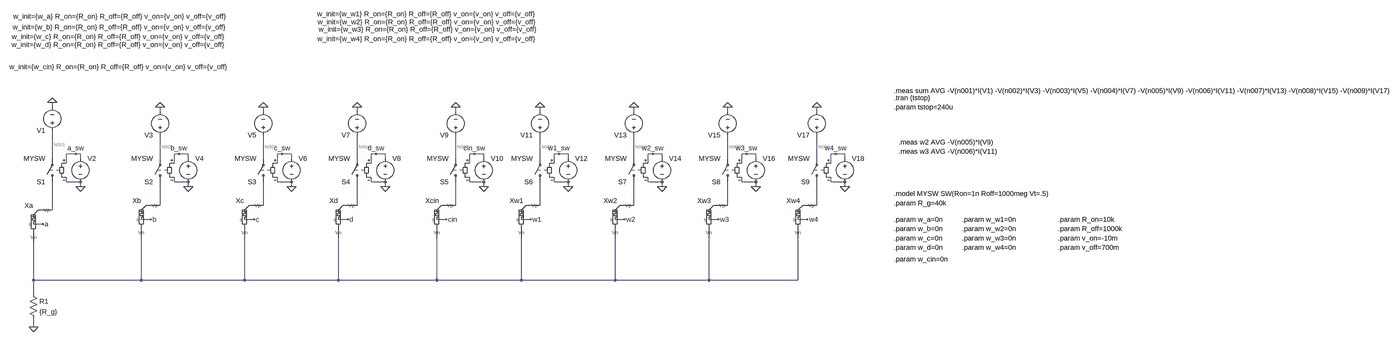
[diagram p0: schematic 1bit_adder_cin.asc, whole sheet]
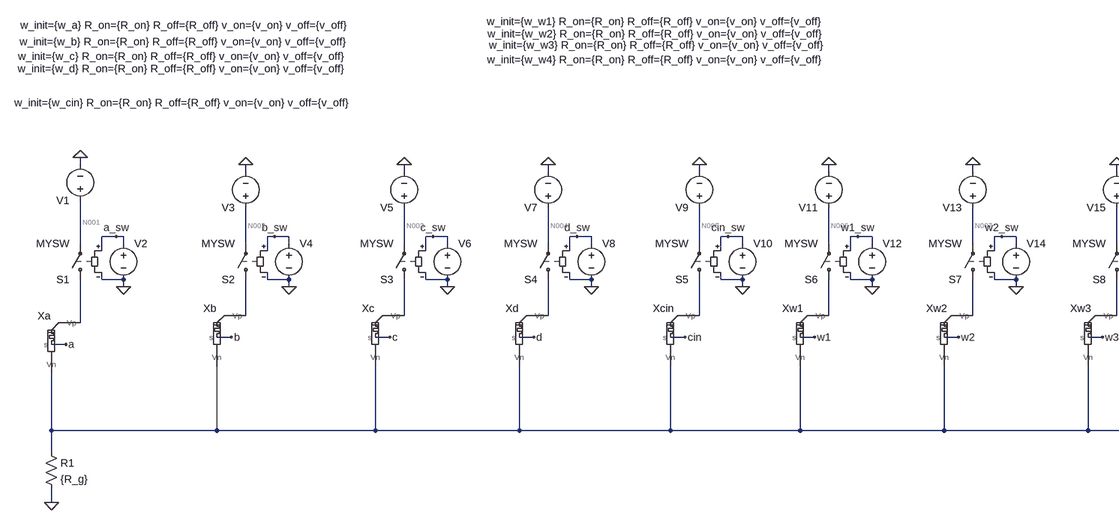
[diagram p1: schematic 1bit_adder_cin.asc, part, row 1 of 1, column 1 of 2]
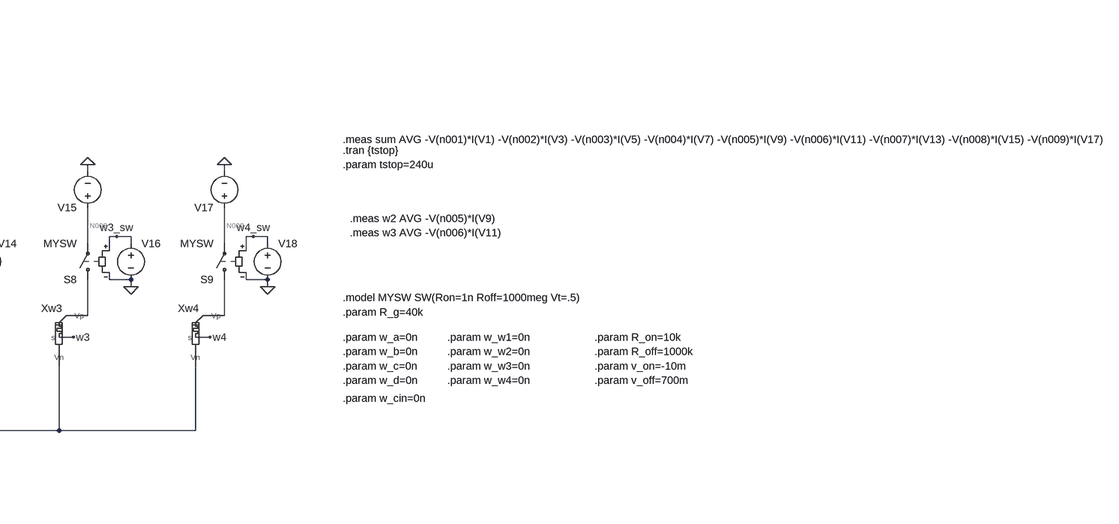
[diagram p2: schematic 1bit_adder_cin.asc, part, row 1 of 1, column 2 of 2]
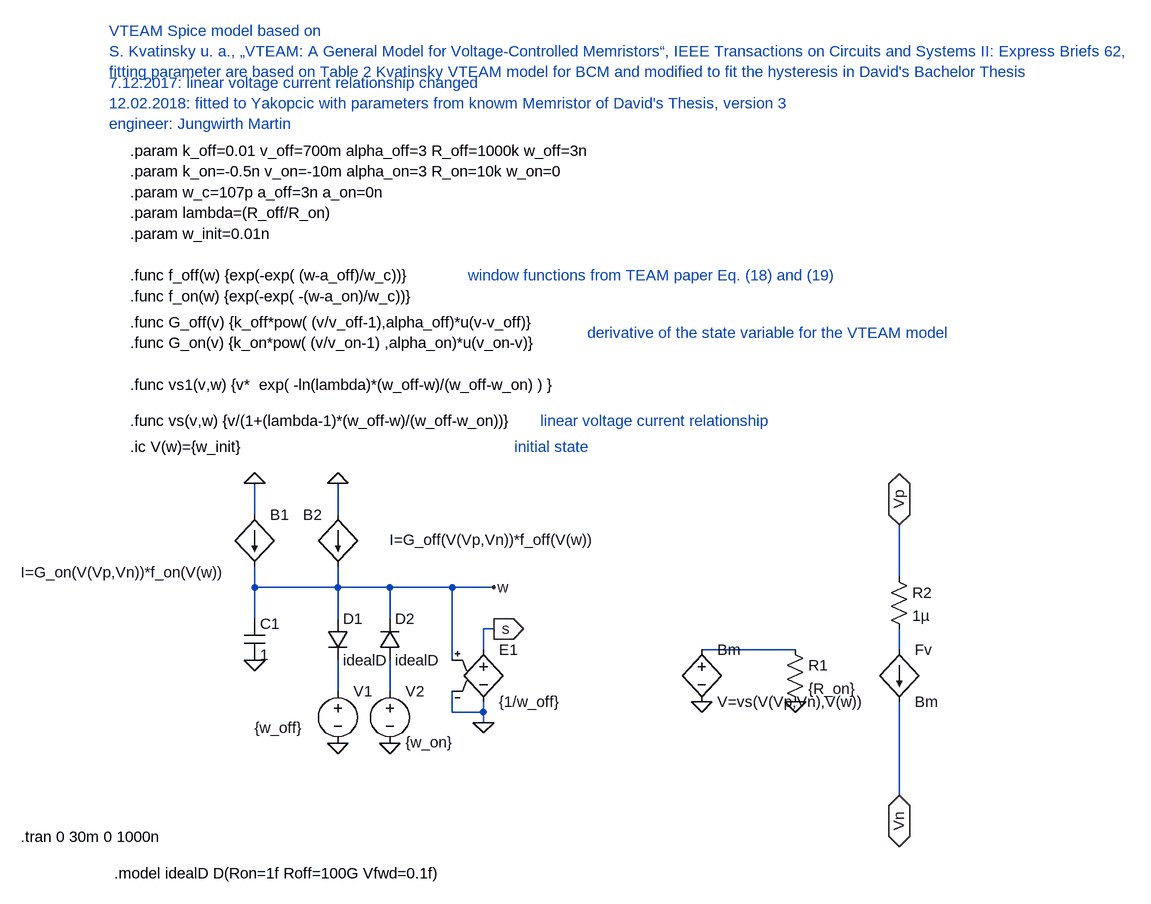
[diagram p3: sub-circuit vteam_knowm.asc]
1bit_adder_cin.asc, the LTspice schematic file:
Version 4
SHEET 1 2940 1840
WIRE -1872 112 -1872 96
WIRE -1504 128 -1504 112
WIRE -1152 128 -1152 112
WIRE -832 128 -832 112
WIRE -496 128 -496 112
WIRE -208 128 -208 112
WIRE 112 128 112 112
WIRE 432 128 432 112
WIRE 736 128 736 112
WIRE -1792 272 -1824 272
WIRE -1776 272 -1792 272
WIRE -1440 272 -1456 272
WIRE -1408 272 -1440 272
WIRE -1088 272 -1104 272
WIRE -1056 272 -1088 272
WIRE -768 272 -784 272
WIRE -736 272 -768 272
WIRE -432 272 -448 272
WIRE -400 272 -432 272
WIRE -144 272 -160 272
WIRE -112 272 -144 272
WIRE 176 272 160 272
WIRE 208 272 176 272
WIRE 496 272 480 272
WIRE 528 272 496 272
WIRE 800 272 784 272
WIRE 832 272 800 272
WIRE -1872 288 -1872 192
WIRE -1776 288 -1776 272
WIRE -1504 288 -1504 208
WIRE -1408 288 -1408 272
WIRE -1152 288 -1152 208
WIRE -1056 288 -1056 272
WIRE -832 288 -832 208
WIRE -736 288 -736 272
WIRE -496 288 -496 208
WIRE -400 288 -400 272
WIRE -208 288 -208 208
WIRE -112 288 -112 272
WIRE 112 288 112 208
WIRE 208 288 208 272
WIRE 432 288 432 208
WIRE 528 288 528 272
WIRE 736 288 736 208
WIRE 832 288 832 272
WIRE -1824 304 -1824 272
WIRE -1456 304 -1456 272
WIRE -1104 304 -1104 272
WIRE -784 304 -784 272
WIRE -448 304 -448 272
WIRE -160 304 -160 272
WIRE 160 304 160 272
WIRE 480 304 480 272
WIRE 784 304 784 272
WIRE -1824 368 -1824 352
WIRE -1776 368 -1824 368
WIRE -1456 368 -1456 352
WIRE -1408 368 -1456 368
WIRE -1104 368 -1104 352
WIRE -1056 368 -1104 368
WIRE -784 368 -784 352
WIRE -736 368 -784 368
WIRE -448 368 -448 352
WIRE -400 368 -448 368
WIRE -160 368 -160 352
WIRE -112 368 -160 368
WIRE 160 368 160 352
WIRE 208 368 160 368
WIRE 480 368 480 352
WIRE 528 368 480 368
WIRE 784 368 784 352
WIRE 832 368 784 368
WIRE -1776 384 -1776 368
WIRE -1408 384 -1408 368
WIRE -1056 384 -1056 368
WIRE -736 384 -736 368
WIRE -400 384 -400 368
WIRE -112 384 -112 368
WIRE 208 384 208 368
WIRE 528 384 528 368
WIRE 832 384 832 368
WIRE -1504 448 -1504 368
WIRE -1152 448 -1152 368
WIRE -832 448 -832 368
WIRE -496 448 -496 368
WIRE -208 448 -208 368
WIRE 112 448 112 368
WIRE 432 448 432 368
WIRE 736 448 736 368
WIRE -1872 464 -1872 368
WIRE -1536 496 -1568 496
WIRE -1184 496 -1216 496
WIRE -864 496 -896 496
WIRE -528 496 -560 496
WIRE -240 496 -272 496
WIRE 80 496 48 496
WIRE 400 496 368 496
WIRE 704 496 672 496
WIRE -1904 512 -1936 512
WIRE -1936 704 -1936 576
WIRE -1568 704 -1568 560
WIRE -1568 704 -1936 704
WIRE -1216 704 -1216 560
WIRE -1216 704 -1568 704
WIRE -896 704 -896 560
WIRE -896 704 -1216 704
WIRE -560 704 -560 560
WIRE -560 704 -896 704
WIRE -272 704 -272 560
WIRE -272 704 -560 704
WIRE 48 704 48 560
WIRE 48 704 -272 704
WIRE 368 704 368 560
WIRE 368 704 48 704
WIRE 672 704 672 560
WIRE 672 704 368 704
WIRE -1936 752 -1936 704
WIRE -1936 864 -1936 832
FLAG -1936 864 0
FLAG -1872 96 0
FLAG -1504 112 0
FLAG -1776 384 0
FLAG -1408 384 0
FLAG -1536 496 b
FLAG -1792 272 a_sw
FLAG -1440 272 b_sw
FLAG -208 112 0
FLAG -112 384 0
FLAG -240 496 w1
FLAG -144 272 w1_sw
FLAG -1904 512 a
FLAG 112 112 0
FLAG 208 384 0
FLAG 80 496 w2
FLAG 176 272 w2_sw
FLAG -1152 112 0
FLAG -1056 384 0
FLAG -1184 496 c
FLAG -1088 272 c_sw
FLAG 432 112 0
FLAG 528 384 0
FLAG 400 496 w3
FLAG 496 272 w3_sw
FLAG -832 112 0
FLAG -736 384 0
FLAG -864 496 d
FLAG -768 272 d_sw
FLAG 736 112 0
FLAG 832 384 0
FLAG 704 496 w4
FLAG 800 272 w4_sw
FLAG -496 112 0
FLAG -400 384 0
FLAG -528 496 cin
FLAG -432 272 cin_sw
SYMBOL res -1952 736 R0
SYMATTR InstName R1
SYMATTR Value {R_g}
SYMBOL voltage -1872 208 R180
WINDOW 3 24 96 Invisible 2
WINDOW 123 0 0 Left 2
WINDOW 39 0 0 Left 2
SYMATTR Value PWL file=a.csv
SYMATTR InstName V1
SYMBOL voltage -1504 224 R180
WINDOW 3 24 96 Invisible 2
WINDOW 123 0 0 Left 2
WINDOW 39 0 0 Left 2
SYMATTR Value PWL file=b.csv
SYMATTR InstName V3
SYMBOL sw -1872 384 R180
SYMATTR InstName S1
SYMATTR Value MYSW
SYMBOL voltage -1776 272 R0
WINDOW 3 24 96 Invisible 2
WINDOW 123 0 0 Left 2
WINDOW 39 0 0 Left 2
SYMATTR Value PWL file=a_sw.csv
SYMATTR InstName V2
SYMBOL sw -1504 384 R180
SYMATTR InstName S2
SYMATTR Value MYSW
SYMBOL voltage -1408 272 R0
WINDOW 3 24 96 Invisible 2
WINDOW 123 0 0 Left 2
WINDOW 39 0 0 Left 2
SYMATTR Value PWL file=b_sw.csv
SYMATTR InstName V4
SYMBOL VTEAM_knowm -1616 448 R0
WINDOW 39 -27 -594 Bottom 2
SYMATTR SpiceLine w_init={w_b} R_on={R_on} R_off={R_off} v_on={v_on} v_off={v_off}
SYMATTR InstName Xb
SYMBOL voltage -208 224 R180
WINDOW 3 24 96 Invisible 2
WINDOW 123 0 0 Left 2
WINDOW 39 0 0 Left 2
SYMATTR Value PWL file=w1.csv
SYMATTR InstName V11
SYMBOL sw -208 384 R180
SYMATTR InstName S6
SYMATTR Value MYSW
SYMBOL voltage -112 272 R0
WINDOW 3 24 96 Invisible 2
WINDOW 123 0 0 Left 2
WINDOW 39 0 0 Left 2
SYMATTR Value PWL file=w1_sw.csv
SYMATTR InstName V12
SYMBOL VTEAM_knowm -320 448 R0
WINDOW 39 -276 -639 Bottom 2
SYMATTR SpiceLine w_init={w_w1} R_on={R_on} R_off={R_off} v_on={v_on} v_off={v_off}
SYMATTR InstName Xw1
SYMBOL VTEAM_knowm -1984 464 R0
WINDOW 39 343 -646 Bottom 2
SYMATTR SpiceLine w_init={w_a} R_on={R_on} R_off={R_off} v_on={v_on} v_off={v_off}
SYMATTR InstName Xa
SYMBOL voltage 112 224 R180
WINDOW 3 24 96 Invisible 2
WINDOW 123 0 0 Left 2
WINDOW 39 0 0 Left 2
SYMATTR Value PWL file=w2.csv
SYMATTR InstName V13
SYMBOL sw 112 384 R180
SYMATTR InstName S7
SYMATTR Value MYSW
SYMBOL voltage 208 272 R0
WINDOW 3 24 96 Invisible 2
WINDOW 123 0 0 Left 2
WINDOW 39 0 0 Left 2
SYMATTR Value PWL file=w2_sw.csv
SYMATTR InstName V14
SYMBOL VTEAM_knowm 0 448 R0
WINDOW 39 -594 -611 Bottom 2
SYMATTR SpiceLine w_init={w_w2} R_on={R_on} R_off={R_off} v_on={v_on} v_off={v_off}
SYMATTR InstName Xw2
SYMBOL voltage -1152 224 R180
WINDOW 3 24 96 Invisible 2
WINDOW 123 0 0 Left 2
WINDOW 39 0 0 Left 2
SYMATTR Value PWL file=c.csv
SYMATTR InstName V5
SYMBOL sw -1152 384 R180
SYMATTR InstName S3
SYMATTR Value MYSW
SYMBOL voltage -1056 272 R0
WINDOW 3 24 96 Invisible 2
WINDOW 123 0 0 Left 2
WINDOW 39 0 0 Left 2
SYMATTR Value PWL file=c_sw.csv
SYMATTR InstName V6
SYMBOL VTEAM_knowm -1264 448 R0
WINDOW 39 -383 -561 Bottom 2
SYMATTR SpiceLine w_init={w_c} R_on={R_on} R_off={R_off} v_on={v_on} v_off={v_off}
SYMATTR InstName Xc
SYMBOL voltage 432 224 R180
WINDOW 3 24 96 Invisible 2
WINDOW 123 0 0 Left 2
WINDOW 39 0 0 Left 2
SYMATTR Value PWL file=w3.csv
SYMATTR InstName V15
SYMBOL sw 432 384 R180
SYMATTR InstName S8
SYMATTR Value MYSW
SYMBOL voltage 528 272 R0
WINDOW 3 24 96 Invisible 2
WINDOW 123 0 0 Left 2
WINDOW 39 0 0 Left 2
SYMATTR Value PWL file=w3_sw.csv
SYMATTR InstName V16
SYMBOL VTEAM_knowm 320 448 R0
WINDOW 39 -911 -586 Bottom 2
SYMATTR SpiceLine w_init={w_w3} R_on={R_on} R_off={R_off} v_on={v_on} v_off={v_off}
SYMATTR InstName Xw3
SYMBOL voltage -832 224 R180
WINDOW 3 24 96 Invisible 2
WINDOW 123 0 0 Left 2
WINDOW 39 0 0 Left 2
SYMATTR Value PWL file=d.csv
SYMATTR InstName V7
SYMBOL sw -832 384 R180
SYMATTR InstName S4
SYMATTR Value MYSW
SYMBOL voltage -736 272 R0
WINDOW 3 24 96 Invisible 2
WINDOW 123 0 0 Left 2
WINDOW 39 0 0 Left 2
SYMATTR Value PWL file=d_sw.csv
SYMATTR InstName V8
SYMBOL VTEAM_knowm -944 448 R0
WINDOW 39 -703 -534 Bottom 2
SYMATTR SpiceLine w_init={w_d} R_on={R_on} R_off={R_off} v_on={v_on} v_off={v_off}
SYMATTR InstName Xd
SYMBOL voltage 736 224 R180
WINDOW 3 24 96 Invisible 2
WINDOW 123 0 0 Left 2
WINDOW 39 0 0 Left 2
SYMATTR Value PWL file=w4.csv
SYMATTR InstName V17
SYMBOL sw 736 384 R180
SYMATTR InstName S9
SYMATTR Value MYSW
SYMBOL voltage 832 272 R0
WINDOW 3 24 96 Invisible 2
WINDOW 123 0 0 Left 2
WINDOW 39 0 0 Left 2
SYMATTR Value PWL file=w4_sw.csv
SYMATTR InstName V18
SYMBOL VTEAM_knowm 624 448 R0
WINDOW 39 -1219 -554 Bottom 2
SYMATTR SpiceLine w_init={w_w4} R_on={R_on} R_off={R_off} v_on={v_on} v_off={v_off}
SYMATTR InstName Xw4
SYMBOL voltage -496 224 R180
WINDOW 3 24 96 Invisible 2
WINDOW 123 0 0 Left 2
WINDOW 39 0 0 Left 2
SYMATTR Value PWL file=cin.csv
SYMATTR InstName V9
SYMBOL sw -496 384 R180
SYMATTR InstName S5
SYMATTR Value MYSW
SYMBOL voltage -400 272 R0
WINDOW 3 24 96 Invisible 2
WINDOW 123 0 0 Left 2
WINDOW 39 0 0 Left 2
SYMATTR Value PWL file=cin_sw.csv
SYMATTR InstName V10
SYMBOL VTEAM_knowm -608 448 R0
WINDOW 39 -1038 -458 Bottom 2
SYMATTR SpiceLine w_init={w_cin} R_on={R_on} R_off={R_off} v_on={v_on} v_off={v_off}
SYMATTR InstName Xcin
TEXT 1016 408 Left 2 !.model MYSW SW(Ron=1n Roff=1000meg Vt=.5)
TEXT 1016 440 Left 2 !.param R_g=40k
TEXT 1016 80 Left 2 !.tran {tstop}
TEXT 1016 496 Left 2 !.param w_a=0n
TEXT 1016 528 Left 2 !.param w_b=0n
TEXT 1016 560 Left 2 !.param w_c=0n
TEXT 1248 496 Left 2 !.param w_w1=0n
TEXT 1248 528 Left 2 !.param w_w2=0n
TEXT 1248 560 Left 2 !.param w_w3=0n
TEXT 1576 496 Left 2 !.param R_on=10k
TEXT 1576 528 Left 2 !.param R_off=1000k
TEXT 1016 56 Left 2 !.meas sum AVG -V(n001)*I(V1) -V(n002)*I(V3) -V(n003)*I(V5) -V(n004)*I(V7) -V(n005)*I(V9) -V(n006)*I(V11) -V(n007)*I(V13) -V(n008)*I(V15) -V(n009)*I(V17)
TEXT 1016 112 Left 2 !.param tstop=240u
TEXT 1032 232 Left 2 !.meas w2 AVG -V(n005)*I(V9)
TEXT 1032 264 Left 2 !.meas w3 AVG -V(n006)*I(V11)
TEXT 1016 592 Left 2 !.param w_d=0n
TEXT 1248 592 Left 2 !.param w_w4=0n
TEXT 1016 632 Left 2 !.param w_cin=0n
TEXT 1576 560 Left 2 !.param v_on=-10m
TEXT 1576 592 Left 2 !.param v_off=700m

vteam_knowm.asc, the sub-circuit schematic file:
Version 4
SHEET 1 2456 1664
WIRE 208 576 208 528
WIRE 336 576 336 528
WIRE 1200 672 1200 592
WIRE 208 688 208 656
WIRE 336 688 336 656
WIRE 336 688 208 688
WIRE 416 688 336 688
WIRE 512 688 416 688
WIRE 576 688 512 688
WIRE 208 736 208 688
WIRE 336 736 336 688
WIRE 416 736 416 688
WIRE 576 752 560 752
WIRE 560 784 560 752
WIRE 1040 784 896 784
WIRE 1200 784 1200 752
WIRE 512 800 512 688
WIRE 336 848 336 800
WIRE 416 848 416 800
WIRE 512 880 512 848
WIRE 560 880 560 864
WIRE 560 880 512 880
WIRE 560 896 560 880
WIRE 1200 1008 1200 864
FLAG 208 528 0
FLAG 336 528 0
FLAG 208 800 0
FLAG 336 928 0
FLAG 416 928 0
FLAG 576 688 w
FLAG 896 864 0
FLAG 1040 864 0
FLAG 1200 592 Vp
IOPIN 1200 592 BiDir
FLAG 1200 1008 Vn
IOPIN 1200 1008 BiDir
FLAG 560 896 0
FLAG 576 752 s
IOPIN 576 752 Out
SYMBOL bi 208 576 R0
WINDOW 3 -360 89 Left 2
SYMATTR Value I=G_on(V(Vp,Vn))*f_on(V(w))
SYMATTR InstName B1
SYMBOL bi 336 576 M0
WINDOW 3 -396 39 Left 2
SYMATTR Value I=G_off(V(Vp,Vn))*f_off(V(w))
SYMATTR InstName B2
SYMBOL cap 192 736 R0
SYMATTR InstName C1
SYMATTR Value 1
SYMBOL diode 320 736 R0
SYMATTR InstName D1
SYMATTR Value idealD
SYMBOL diode 400 800 M180
WINDOW 0 24 64 Left 2
WINDOW 3 24 0 Left 2
SYMATTR InstName D2
SYMATTR Value idealD
SYMBOL voltage 336 832 R0
WINDOW 123 0 0 Left 2
WINDOW 39 0 0 Left 2
WINDOW 3 -128 72 Left 2
SYMATTR Value {w_off}
SYMATTR InstName V1
SYMBOL voltage 416 832 R0
WINDOW 3 24 94 Left 2
WINDOW 123 0 0 Left 2
WINDOW 39 0 0 Left 2
SYMATTR Value {w_on}
SYMATTR InstName V2
SYMBOL res 1024 768 R0
SYMATTR InstName R1
SYMATTR Value {R_on}
SYMBOL f 1200 784 R0
SYMATTR InstName Fv
SYMATTR Value Bm
SYMATTR Value2 -1
SYMBOL bv 896 768 R0
SYMATTR InstName Bm
SYMATTR Value V=vs(V(Vp,Vn),V(w))
SYMBOL e 560 768 R0
SYMATTR InstName E1
SYMATTR Value {1/w_off}
SYMBOL res 1184 656 R0
SYMATTR InstName R2
SYMATTR Value 1µ
TEXT 16 16 Left 2 !.param k_off=0.01 v_off=700m alpha_off=3 R_off=1000k w_off=3n
TEXT 16 48 Left 2 !.param k_on=-0.5n v_on=-10m alpha_on=3 R_on=10k w_on=0
TEXT 16 80 Left 2 !.param w_c=107p a_off=3n a_on=0n
TEXT 16 208 Left 2 !.func f_off(w) {exp(-exp( (w-a_off)/w_c))}
TEXT 16 240 Left 2 !.func f_on(w) {exp(-exp( -(w-a_on)/w_c))}
TEXT 16 280 Left 2 !.func G_off(v) {k_off*pow( (v/v_off-1),alpha_off)*u(v-v_off)}
TEXT 16 312 Left 2 !.func G_on(v) {k_on*pow( (v/v_on-1) ,alpha_on)*u(v_on-v)}
TEXT 16 432 Left 2 !.func vs(v,w) {v/(1+(lambda-1)*(w_off-w)/(w_off-w_on))}
TEXT -16 -168 Left 2 ;VTEAM Spice model based on \nS. Kvatinsky u. a., „VTEAM: A General Model for Voltage-Controlled Memristors“, IEEE Transactions on Circuits and Systems II: Express Briefs 62,\nfitting parameter are based on Table 2 Kvatinsky VTEAM model for BCM and modified to fit the hysteresis in David's Bachelor Thesis
TEXT 16 112 Left 2 !.param lambda=(R_off/R_on)
TEXT 16 472 Left 2 !.ic V(w)={w_init}
TEXT 536 208 Left 2 ;window functions from TEAM paper Eq. (18) and (19)
TEXT 720 296 Left 2 ;derivative of the state variable for the VTEAM model
TEXT 648 432 Left 2 ;linear voltage current relationship
TEXT 608 472 Left 2 ;initial state
TEXT -8 1128 Left 2 !.model idealD D(Ron=1f Roff=100G Vfwd=0.1f)
TEXT 16 144 Left 2 !.param w_init=0.01n
TEXT -16 -88 Left 2 ;7.12.2017: linear voltage current relationship changed\n12.02.2018: fitted to Yakopcic with parameters from knowm Memristor of David's Thesis, version 3\nengineer: Jungwirth Martin
TEXT -152 1072 Left 2 !.tran 0 30m 0 1000n
TEXT 16 376 Left 2 !.func vs1(v,w) {v*  exp( -ln(lambda)*(w_off-w)/(w_off-w_on) ) }

The netlist it stands for:
* 1bit_adder_cin.asc
R1 N019 0 {R_g}
V1 N001 0 PWL file=a.csv
V3 N002 0 PWL file=b.csv
S1 N018 N001 a_sw 0 MYSW
V2 a_sw 0 PWL file=a_sw.csv
S2 N010 N002 b_sw 0 MYSW
V4 b_sw 0 PWL file=b_sw.csv
XXb b N010 N019 vteam_knowm params: w_init={w_b} R_on={R_on} R_off={R_off} v_on={v_on} v_off={v_off}
V11 N006 0 PWL file=w1.csv
S6 N014 N006 w1_sw 0 MYSW
V12 w1_sw 0 PWL file=w1_sw.csv
XXw1 w1 N014 N019 vteam_knowm params: w_init={w_w1} R_on={R_on} R_off={R_off} v_on={v_on} v_off={v_off}
XXa a N018 N019 vteam_knowm params: w_init={w_a} R_on={R_on} R_off={R_off} v_on={v_on} v_off={v_off}
V13 N007 0 PWL file=w2.csv
S7 N015 N007 w2_sw 0 MYSW
V14 w2_sw 0 PWL file=w2_sw.csv
XXw2 w2 N015 N019 vteam_knowm params: w_init={w_w2} R_on={R_on} R_off={R_off} v_on={v_on} v_off={v_off}
V5 N003 0 PWL file=c.csv
S3 N011 N003 c_sw 0 MYSW
V6 c_sw 0 PWL file=c_sw.csv
XXc c N011 N019 vteam_knowm params: w_init={w_c} R_on={R_on} R_off={R_off} v_on={v_on} v_off={v_off}
V15 N008 0 PWL file=w3.csv
S8 N016 N008 w3_sw 0 MYSW
V16 w3_sw 0 PWL file=w3_sw.csv
XXw3 w3 N016 N019 vteam_knowm params: w_init={w_w3} R_on={R_on} R_off={R_off} v_on={v_on} v_off={v_off}
V7 N004 0 PWL file=d.csv
S4 N012 N004 d_sw 0 MYSW
V8 d_sw 0 PWL file=d_sw.csv
XXd d N012 N019 vteam_knowm params: w_init={w_d} R_on={R_on} R_off={R_off} v_on={v_on} v_off={v_off}
V17 N009 0 PWL file=w4.csv
S9 N017 N009 w4_sw 0 MYSW
V18 w4_sw 0 PWL file=w4_sw.csv
XXw4 w4 N017 N019 vteam_knowm params: w_init={w_w4} R_on={R_on} R_off={R_off} v_on={v_on} v_off={v_off}
V9 N005 0 PWL file=cin.csv
S5 N013 N005 cin_sw 0 MYSW
V10 cin_sw 0 PWL file=cin_sw.csv
XXcin cin N013 N019 vteam_knowm params: w_init={w_cin} R_on={R_on} R_off={R_off} v_on={v_on} v_off={v_off}

* block symbol definitions
.subckt vteam_knowm s Vp Vn
B1 0 w I=G_on(V(Vp,Vn))*f_on(V(w))
B2 0 w I=G_off(V(Vp,Vn))*f_off(V(w))
C1 w 0 1
D1 w N003 idealD
D2 N004 w idealD
V1 N003 0 {w_off}
V2 N004 0 {w_on}
R1 N001 0 {R_on}
Fv N002 Vn Bm -1
Bm N001 0 V=vs(V(Vp,Vn),V(w))
E1 s 0 w 0 {1/w_off}
R2 Vp N002 1µ
.param k_off=0.01 v_off=700m alpha_off=3 R_off=1000k w_off=3n
.param k_on=-0.5n v_on=-10m alpha_on=3 R_on=10k w_on=0
.param w_c=107p a_off=3n a_on=0n
.func f_off(w) {exp(-exp( (w-a_off)/w_c))}
.func f_on(w) {exp(-exp( -(w-a_on)/w_c))}
.func G_off(v) {k_off*pow( (v/v_off-1),alpha_off)*u(v-v_off)}
.func G_on(v) {k_on*pow( (v/v_on-1) ,alpha_on)*u(v_on-v)}
.func vs(v,w) {v/(1+(lambda-1)*(w_off-w)/(w_off-w_on))}
* VTEAM Spice model based on
* S. Kvatinsky u. a., „VTEAM: A General Model for Voltage-Controlled Memristors“, IEEE Transactions on Circuits and Systems II: Express Briefs 62,
* fitting parameter are based on Table 2 Kvatinsky VTEAM model for BCM and modified to fit the hysteresis in David's Bachelor Thesis
.param lambda=(R_off/R_on)
.ic V(w)={w_init}
* window functions from TEAM paper Eq. (18) and (19)
* derivative of the state variable for the VTEAM model
* linear voltage current relationship
* initial state
.model idealD D(Ron=1f Roff=100G Vfwd=0.1f)
.param w_init=0.01n
* 7.12.2017: linear voltage current relationship changed
* 12.02.2018: fitted to Yakopcic with parameters from knowm Memristor of David's Thesis, version 3
* engineer: Jungwirth Martin
.tran 0 30m 0 1000n
.func vs1(v,w) {v*  exp( -ln(lambda)*(w_off-w)/(w_off-w_on) ) }
.ends vteam_knowm

.model D D
.lib standard.dio
.model MYSW SW(Ron=1n Roff=1000meg Vt=.5)
.param R_g=40k
.tran {tstop}
.param w_a=0n
.param w_b=0n
.param w_c=0n
.param w_w1=0n
.param w_w2=0n
.param w_w3=0n
.param R_on=10k
.param R_off=1000k
.meas sum AVG -V(n001)*I(V1) -V(n002)*I(V3) -V(n003)*I(V5) -V(n004)*I(V7) -V(n005)*I(V9) -V(n006)*I(V11) -V(n007)*I(V13) -V(n008)*I(V15) -V(n009)*I(V17)
.param tstop=240u
.meas w2 AVG -V(n005)*I(V9)
.meas w3 AVG -V(n006)*I(V11)
.param w_d=0n
.param w_w4=0n
.param w_cin=0n
.param v_on=-10m
.param v_off=700m
.backanno
.end

* Results of the author's LTspice run, read from the files saved beside the schematic
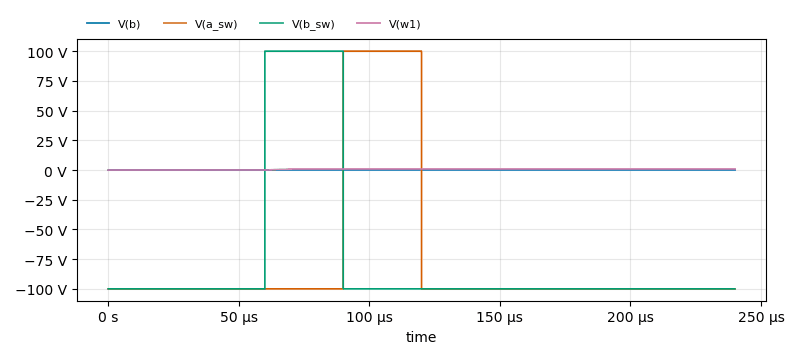
[diagram p4: Transient Analysis of 1bit_adder_cin.asc, plotted from the saved traces]
* Transient Analysis, 1 run:
*   V(b): min 0 V, max 95.96 mV, average 70.71 mV, rms 82.06 mV, last 95.96 mV
*   V(a_sw): min -100 V, max 100 V, average -75 V, rms 100 V, last -100 V
*   V(b_sw): min -100 V, max 100 V, average -75 V, rms 100 V, last -100 V
*   V(w1): min 0 V, max 889.8 mV, average 643.7 mV, rms 749.8 mV, last 889.8 mV
* From the log:
*   sum: AVG(-v(n001)*i(v1) -v(n002)*i(v3) -v(n003)*i(v5) -v(n004)*i(v7) -v(n005)*i(v9) -v(n006)*i(v11) -v(n007)*i(v13) -v(n008)*i(v15))=3.25376e-06 FROM 0 TO 0.00024
*   w2: AVG(-v(n005)*i(v9))=8.04651e-08 FROM 0 TO 0.00024
*   w3: AVG(-v(n006)*i(v11))=1.36535e-06 FROM 0 TO 0.00024